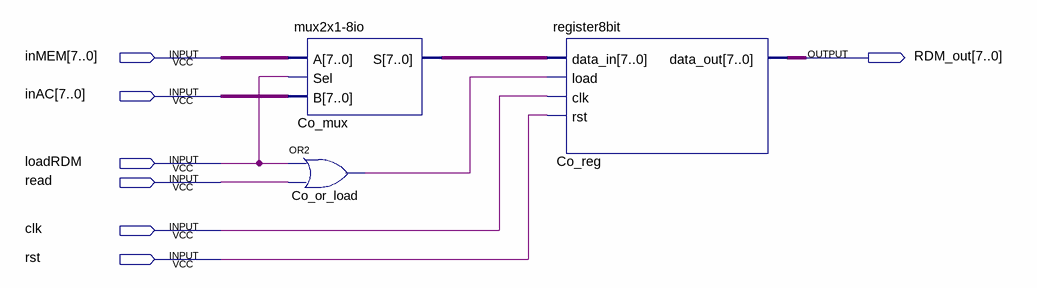
[diagram p0: schematic sheet]
// Quartus schematic regRDM.bdf as structural Verilog: 3 symbols, 7 pins
module regRDM (
  input  [7:0] inMEM,
  input  [7:0] inAC,
  input  loadRDM,
  input  read,
  input  clk,
  input  rst,
  output [7:0] RDM_out
);

  wire Co_or_load_out;
  wire [7:0] Co_mux_s;

  \mux2x1-8io  Co_mux (.A(inMEM), .Sel(loadRDM), .B(inAC), .S(Co_mux_s));
  or Co_or_load (Co_or_load_out, loadRDM, read);
  register8bit Co_reg (.data_in(Co_mux_s), .load(Co_or_load_out), .clk(clk), .rst(rst), .data_out(RDM_out));
endmodule
